# EAGLE design ESP32_WROVER_iot_module (EAGLE 9.6.2)
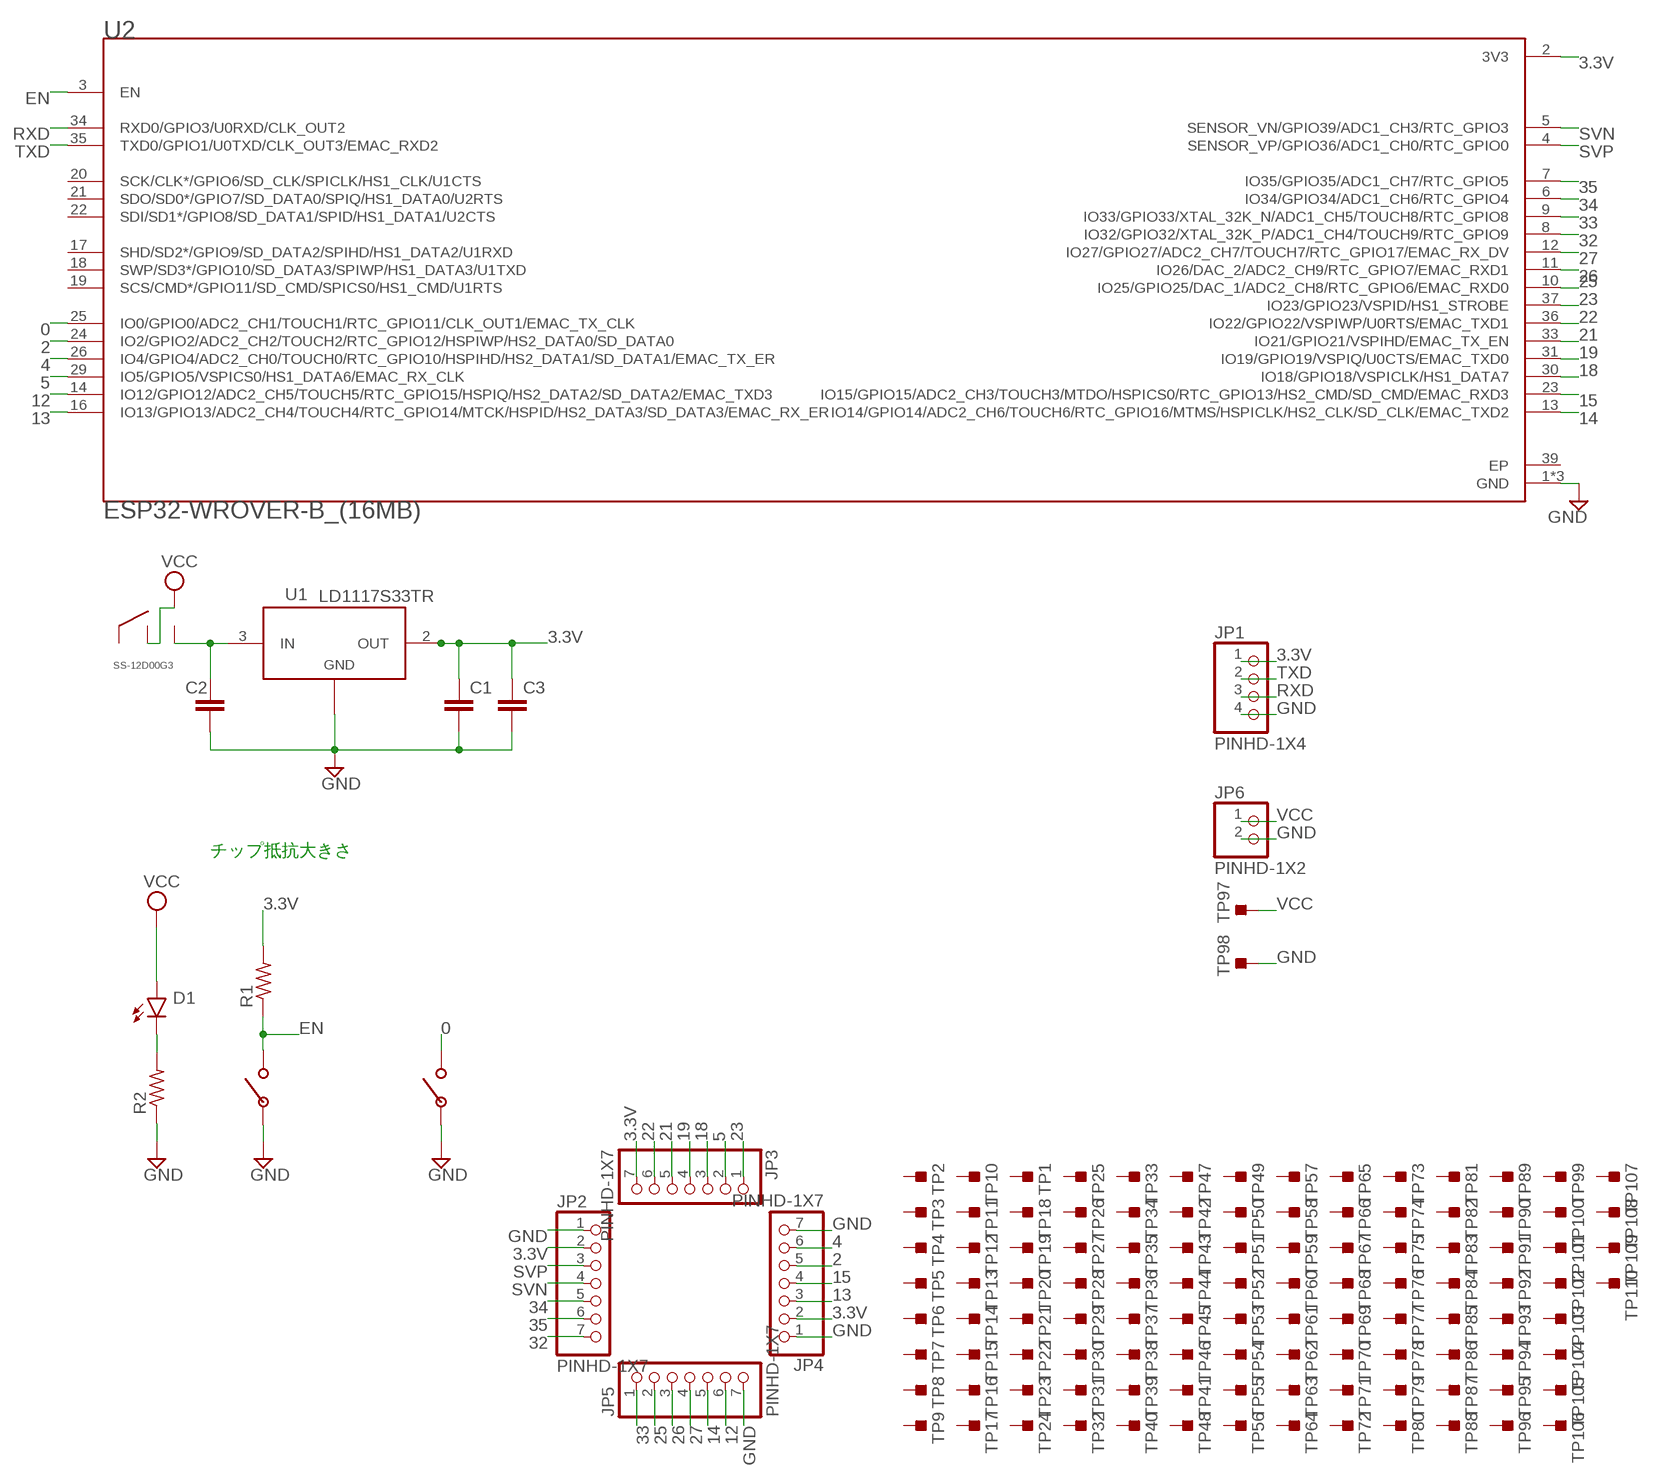
[diagram p0: schematic, sheet 1]

## Parts
C1  C-EUC0805K  [C0805K]
C2  C-EUC0805K  [C0805K]
C3  C-EUC0805K  [C0805K]
D1  LED_BLUE  LED_CHIP_BLUE-1608  [LEDC1608X39N_B]
JP1  PINHD-1X4  [1X04]
JP2  PINHD-1X7  [1X07]
JP3  PINHD-1X7  [1X07]
JP4  PINHD-1X7  [1X07]
JP5  PINHD-1X7  [1X07]
JP6  PINHD-1X2  [1X02]
R1  R-US_R0603  [R0603]
R2  R-US_R0603  [R0603]
SW1  TVAF06-A020B-R  [TVAF06-A020B-R]
SW2  TVAF06-A020B-R  [TVAF06-A020B-R]
SW3  SS-12D00G3  [SS-12D00G3]
TP1  TESTPOINT_TPS-PAD-036  [TESTPOINT_PAD-036]
TP2  TESTPOINT_TPS-PAD-036  [TESTPOINT_PAD-036]
TP3  TESTPOINT_TPS-PAD-036  [TESTPOINT_PAD-036]
TP4  TESTPOINT_TPS-PAD-036  [TESTPOINT_PAD-036]
TP5  TESTPOINT_TPS-PAD-036  [TESTPOINT_PAD-036]
TP6  TESTPOINT_TPS-PAD-036  [TESTPOINT_PAD-036]
TP7  TESTPOINT_TPS-PAD-036  [TESTPOINT_PAD-036]
TP8  TESTPOINT_TPS-PAD-036  [TESTPOINT_PAD-036]
TP9  TESTPOINT_TPS-PAD-036  [TESTPOINT_PAD-036]
TP10  TESTPOINT_TPS-PAD-036  [TESTPOINT_PAD-036]
TP11  TESTPOINT_TPS-PAD-036  [TESTPOINT_PAD-036]
TP12  TESTPOINT_TPS-PAD-036  [TESTPOINT_PAD-036]
TP13  TESTPOINT_TPS-PAD-036  [TESTPOINT_PAD-036]
TP14  TESTPOINT_TPS-PAD-036  [TESTPOINT_PAD-036]
TP15  TESTPOINT_TPS-PAD-036  [TESTPOINT_PAD-036]
TP16  TESTPOINT_TPS-PAD-036  [TESTPOINT_PAD-036]
TP17  TESTPOINT_TPS-PAD-036  [TESTPOINT_PAD-036]
TP18  TESTPOINT_TPS-PAD-036  [TESTPOINT_PAD-036]
TP19  TESTPOINT_TPS-PAD-036  [TESTPOINT_PAD-036]
TP20  TESTPOINT_TPS-PAD-036  [TESTPOINT_PAD-036]
TP21  TESTPOINT_TPS-PAD-036  [TESTPOINT_PAD-036]
TP22  TESTPOINT_TPS-PAD-036  [TESTPOINT_PAD-036]
TP23  TESTPOINT_TPS-PAD-036  [TESTPOINT_PAD-036]
TP24  TESTPOINT_TPS-PAD-036  [TESTPOINT_PAD-036]
TP25  TESTPOINT_TPS-PAD-036  [TESTPOINT_PAD-036]
TP26  TESTPOINT_TPS-PAD-036  [TESTPOINT_PAD-036]
TP27  TESTPOINT_TPS-PAD-036  [TESTPOINT_PAD-036]
TP28  TESTPOINT_TPS-PAD-036  [TESTPOINT_PAD-036]
TP29  TESTPOINT_TPS-PAD-036  [TESTPOINT_PAD-036]
TP30  TESTPOINT_TPS-PAD-036  [TESTPOINT_PAD-036]
TP31  TESTPOINT_TPS-PAD-036  [TESTPOINT_PAD-036]
TP32  TESTPOINT_TPS-PAD-036  [TESTPOINT_PAD-036]
TP33  TESTPOINT_TPS-PAD-036  [TESTPOINT_PAD-036]
TP34  TESTPOINT_TPS-PAD-036  [TESTPOINT_PAD-036]
TP35  TESTPOINT_TPS-PAD-036  [TESTPOINT_PAD-036]
TP36  TESTPOINT_TPS-PAD-036  [TESTPOINT_PAD-036]
TP37  TESTPOINT_TPS-PAD-036  [TESTPOINT_PAD-036]
TP38  TESTPOINT_TPS-PAD-036  [TESTPOINT_PAD-036]
TP39  TESTPOINT_TPS-PAD-036  [TESTPOINT_PAD-036]
TP40  TESTPOINT_TPS-PAD-036  [TESTPOINT_PAD-036]
TP41  TESTPOINT_TPS-PAD-036  [TESTPOINT_PAD-036]
TP42  TESTPOINT_TPS-PAD-036  [TESTPOINT_PAD-036]
TP43  TESTPOINT_TPS-PAD-036  [TESTPOINT_PAD-036]
TP44  TESTPOINT_TPS-PAD-036  [TESTPOINT_PAD-036]
TP45  TESTPOINT_TPS-PAD-036  [TESTPOINT_PAD-036]
TP46  TESTPOINT_TPS-PAD-036  [TESTPOINT_PAD-036]
TP47  TESTPOINT_TPS-PAD-036  [TESTPOINT_PAD-036]
TP48  TESTPOINT_TPS-PAD-036  [TESTPOINT_PAD-036]
TP49  TESTPOINT_TPS-PAD-036  [TESTPOINT_PAD-036]
TP50  TESTPOINT_TPS-PAD-036  [TESTPOINT_PAD-036]
TP51  TESTPOINT_TPS-PAD-036  [TESTPOINT_PAD-036]
TP52  TESTPOINT_TPS-PAD-036  [TESTPOINT_PAD-036]
TP53  TESTPOINT_TPS-PAD-036  [TESTPOINT_PAD-036]
TP54  TESTPOINT_TPS-PAD-036  [TESTPOINT_PAD-036]
TP55  TESTPOINT_TPS-PAD-036  [TESTPOINT_PAD-036]
TP56  TESTPOINT_TPS-PAD-036  [TESTPOINT_PAD-036]
TP57  TESTPOINT_TPS-PAD-036  [TESTPOINT_PAD-036]
TP58  TESTPOINT_TPS-PAD-036  [TESTPOINT_PAD-036]
TP59  TESTPOINT_TPS-PAD-036  [TESTPOINT_PAD-036]
TP60  TESTPOINT_TPS-PAD-036  [TESTPOINT_PAD-036]
TP61  TESTPOINT_TPS-PAD-036  [TESTPOINT_PAD-036]
TP62  TESTPOINT_TPS-PAD-036  [TESTPOINT_PAD-036]
TP63  TESTPOINT_TPS-PAD-036  [TESTPOINT_PAD-036]
TP64  TESTPOINT_TPS-PAD-036  [TESTPOINT_PAD-036]
TP65  TESTPOINT_TPS-PAD-036  [TESTPOINT_PAD-036]
TP66  TESTPOINT_TPS-PAD-036  [TESTPOINT_PAD-036]
TP67  TESTPOINT_TPS-PAD-036  [TESTPOINT_PAD-036]
TP68  TESTPOINT_TPS-PAD-036  [TESTPOINT_PAD-036]
TP69  TESTPOINT_TPS-PAD-036  [TESTPOINT_PAD-036]
TP70  TESTPOINT_TPS-PAD-036  [TESTPOINT_PAD-036]
TP71  TESTPOINT_TPS-PAD-036  [TESTPOINT_PAD-036]
TP72  TESTPOINT_TPS-PAD-036  [TESTPOINT_PAD-036]
TP73  TESTPOINT_TPS-PAD-036  [TESTPOINT_PAD-036]
TP74  TESTPOINT_TPS-PAD-036  [TESTPOINT_PAD-036]
TP75  TESTPOINT_TPS-PAD-036  [TESTPOINT_PAD-036]
TP76  TESTPOINT_TPS-PAD-036  [TESTPOINT_PAD-036]
TP77  TESTPOINT_TPS-PAD-036  [TESTPOINT_PAD-036]
TP78  TESTPOINT_TPS-PAD-036  [TESTPOINT_PAD-036]
TP79  TESTPOINT_TPS-PAD-036  [TESTPOINT_PAD-036]
TP80  TESTPOINT_TPS-PAD-036  [TESTPOINT_PAD-036]
TP81  TESTPOINT_TPS-PAD-036  [TESTPOINT_PAD-036]
TP82  TESTPOINT_TPS-PAD-036  [TESTPOINT_PAD-036]
TP83  TESTPOINT_TPS-PAD-036  [TESTPOINT_PAD-036]
TP84  TESTPOINT_TPS-PAD-036  [TESTPOINT_PAD-036]
TP85  TESTPOINT_TPS-PAD-036  [TESTPOINT_PAD-036]
TP86  TESTPOINT_TPS-PAD-036  [TESTPOINT_PAD-036]
TP87  TESTPOINT_TPS-PAD-036  [TESTPOINT_PAD-036]
TP88  TESTPOINT_TPS-PAD-036  [TESTPOINT_PAD-036]
TP89  TESTPOINT_TPS-PAD-036  [TESTPOINT_PAD-036]
TP90  TESTPOINT_TPS-PAD-036  [TESTPOINT_PAD-036]
TP91  TESTPOINT_TPS-PAD-036  [TESTPOINT_PAD-036]
TP92  TESTPOINT_TPS-PAD-036  [TESTPOINT_PAD-036]
TP93  TESTPOINT_TPS-PAD-036  [TESTPOINT_PAD-036]
TP94  TESTPOINT_TPS-PAD-036  [TESTPOINT_PAD-036]
TP95  TESTPOINT_TPS-PAD-036  [TESTPOINT_PAD-036]
TP96  TESTPOINT_TPS-PAD-036  [TESTPOINT_PAD-036]
TP97  TESTPOINT_TPS-PAD-036  [TESTPOINT_PAD-036]
TP98  TESTPOINT_TPS-PAD-036  [TESTPOINT_PAD-036]
TP99  TESTPOINT_TPS-PAD-036  [TESTPOINT_PAD-036]
TP100  TESTPOINT_TPS-PAD-036  [TESTPOINT_PAD-036]
TP101  TESTPOINT_TPS-PAD-036  [TESTPOINT_PAD-036]
TP102  TESTPOINT_TPS-PAD-036  [TESTPOINT_PAD-036]
TP103  TESTPOINT_TPS-PAD-036  [TESTPOINT_PAD-036]
TP104  TESTPOINT_TPS-PAD-036  [TESTPOINT_PAD-036]
TP105  TESTPOINT_TPS-PAD-036  [TESTPOINT_PAD-036]
TP106  TESTPOINT_TPS-PAD-036  [TESTPOINT_PAD-036]
TP107  TESTPOINT_TPS-PAD-036  [TESTPOINT_PAD-036]
TP108  TESTPOINT_TPS-PAD-036  [TESTPOINT_PAD-036]
TP109  TESTPOINT_TPS-PAD-036  [TESTPOINT_PAD-036]
TP110  TESTPOINT_TPS-PAD-036  [TESTPOINT_PAD-036]
U1  LD1117S33TR  [SOT-223]
U2  ESP32-WROVER-B_(16MB)  [XCVR_ESP32-WROVER-B_(16MB)]

## Nets
0: SW2.P$1 U2.25(IO0/GPIO0/ADC2_CH1/TOUCH1/RTC_GPIO11/CLK_OUT1/EMAC_TX_CLK)
2: JP4.5 U2.24(IO2/GPIO2/ADC2_CH2/TOUCH2/RTC_GPIO12/HSPIWP/HS2_DATA0/SD_DATA0)
3.3V [supply]: C1.1 C3.1 JP1.1 JP2.2 JP3.7 JP4.2 R1.2 U1.2(OUT) U1.4 U2.2(3V3)
4: JP4.6 U2.26(IO4/GPIO4/ADC2_CH0/TOUCH0/RTC_GPIO10/HSPIHD/HS2_DATA1/SD_DATA1/EMAC_TX_ER)
5: JP3.2 U2.29(IO5/GPIO5/VSPICS0/HS1_DATA6/EMAC_RX_CLK)
12: JP5.6 U2.14(IO12/GPIO12/ADC2_CH5/TOUCH5/RTC_GPIO15/HSPIQ/HS2_DATA2/SD_DATA2/EMAC_TXD3)
13: JP4.3 U2.16(IO13/GPIO13/ADC2_CH4/TOUCH4/RTC_GPIO14/MTCK/HSPID/HS2_DATA3/SD_DATA3/EMAC_RX_ER)
14: JP5.5 U2.13(IO14/GPIO14/ADC2_CH6/TOUCH6/RTC_GPIO16/MTMS/HSPICLK/HS2_CLK/SD_CLK/EMAC_TXD2)
15: JP4.4 U2.23(IO15/GPIO15/ADC2_CH3/TOUCH3/MTDO/HSPICS0/RTC_GPIO13/HS2_CMD/SD_CMD/EMAC_RXD3)
18: JP3.3 U2.30(IO18/GPIO18/VSPICLK/HS1_DATA7)
19: JP3.4 U2.31(IO19/GPIO19/VSPIQ/U0CTS/EMAC_TXD0)
21: JP3.5 U2.33(IO21/GPIO21/VSPIHD/EMAC_TX_EN)
22: JP3.6 U2.36(IO22/GPIO22/VSPIWP/U0RTS/EMAC_TXD1)
23: JP3.1 U2.37(IO23/GPIO23/VSPID/HS1_STROBE)
25: JP5.2 U2.10(IO25/GPIO25/DAC_1/ADC2_CH8/RTC_GPIO6/EMAC_RXD0)
26: JP5.3 U2.11(IO26/DAC_2/ADC2_CH9/RTC_GPIO7/EMAC_RXD1)
27: JP5.4 U2.12(IO27/GPIO27/ADC2_CH7/TOUCH7/RTC_GPIO17/EMAC_RX_DV)
32: JP2.7 U2.8(IO32/GPIO32/XTAL_32K_P/ADC1_CH4/TOUCH9/RTC_GPIO9)
33: JP5.1 U2.9(IO33/GPIO33/XTAL_32K_N/ADC1_CH5/TOUCH8/RTC_GPIO8)
34: JP2.5 U2.6(IO34/GPIO34/ADC1_CH6/RTC_GPIO4)
35: JP2.6 U2.7(IO35/GPIO35/ADC1_CH7/RTC_GPIO5)
EN: R1.1 SW1.P$1 U2.3(EN)
GND [supply]: C1.2 C2.2 C3.2 JP1.4 JP2.1 JP4.1 JP4.7 JP5.7 JP6.2 R2.1 SW1.P$2 SW2.P$2 TP98.1(TP) U1.1(ADJ/GND) U2.1(GND) U2.15(GND) U2.38(GND)
N$1: D1.1(C) R2.2
RXD: JP1.3 U2.34(RXD0/GPIO3/U0RXD/CLK_OUT2)
SVN: JP2.4 U2.5(SENSOR_VN/GPIO39/ADC1_CH3/RTC_GPIO3)
SVP: JP2.3 U2.4(SENSOR_VP/GPIO36/ADC1_CH0/RTC_GPIO0)
TXD: JP1.2 U2.35(TXD0/GPIO1/U0TXD/CLK_OUT3/EMAC_RXD2)
VCC [supply]: D1.2(A) JP6.1 SW3.P$2 TP97.1(TP)
VIN [supply]: C2.1 SW3.P$3 U1.3(IN)
Unconnected: SW3.P$1 TP1.1(TP) TP2.1(TP) TP3.1(TP) TP4.1(TP) TP5.1(TP) TP6.1(TP) TP7.1(TP) TP8.1(TP) TP9.1(TP) TP10.1(TP) TP11.1(TP) TP12.1(TP) TP13.1(TP) TP14.1(TP) TP15.1(TP) TP16.1(TP) TP17.1(TP) TP18.1(TP) TP19.1(TP) TP20.1(TP) TP21.1(TP) TP22.1(TP) TP23.1(TP) TP24.1(TP) TP25.1(TP) TP26.1(TP) TP27.1(TP) TP28.1(TP) TP29.1(TP) TP30.1(TP) TP31.1(TP) TP32.1(TP) TP33.1(TP) TP34.1(TP) TP35.1(TP) TP36.1(TP) TP37.1(TP) TP38.1(TP) TP39.1(TP) TP40.1(TP) TP41.1(TP) TP42.1(TP) TP43.1(TP) TP44.1(TP) TP45.1(TP) TP46.1(TP) TP47.1(TP) TP48.1(TP) TP49.1(TP) TP50.1(TP) TP51.1(TP) TP52.1(TP) TP53.1(TP) TP54.1(TP) TP55.1(TP) TP56.1(TP) TP57.1(TP) TP58.1(TP) TP59.1(TP) TP60.1(TP) TP61.1(TP) TP62.1(TP) TP63.1(TP) TP64.1(TP) TP65.1(TP) TP66.1(TP) TP67.1(TP) TP68.1(TP) TP69.1(TP) TP70.1(TP) TP71.1(TP) TP72.1(TP) TP73.1(TP) TP74.1(TP) TP75.1(TP) TP76.1(TP) TP77.1(TP) TP78.1(TP) TP79.1(TP) TP80.1(TP) TP81.1(TP) TP82.1(TP) TP83.1(TP) TP84.1(TP) TP85.1(TP) TP86.1(TP) TP87.1(TP) TP88.1(TP) TP89.1(TP) TP90.1(TP) TP91.1(TP) TP92.1(TP) TP93.1(TP) TP94.1(TP) TP95.1(TP) TP96.1(TP) TP99.1(TP) TP100.1(TP) TP101.1(TP) TP102.1(TP) TP103.1(TP) TP104.1(TP) TP105.1(TP) TP106.1(TP) TP107.1(TP) TP108.1(TP) TP109.1(TP) TP110.1(TP) U2.17(SHD/SD2*/GPIO9/SD_DATA2/SPIHD/HS1_DATA2/U1RXD) U2.18(SWP/SD3*/GPIO10/SD_DATA3/SPIWP/HS1_DATA3/U1TXD) U2.19(SCS/CMD*/GPIO11/SD_CMD/SPICS0/HS1_CMD/U1RTS) U2.20(SCK/CLK*/GPIO6/SD_CLK/SPICLK/HS1_CLK/U1CTS) U2.21(SDO/SD0*/GPIO7/SD_DATA0/SPIQ/HS1_DATA0/U2RTS) U2.22(SDI/SD1*/GPIO8/SD_DATA1/SPID/HS1_DATA1/U2CTS)

## Notes on the sheet
- チップ抵抗大きさ

## Power pins joined to a net without a drawn wire
GND: U2.39(EP)

## Library data of the parts
C1-C3 = myParts:C-EU: CAPACITOR, European symbol; SPICEPREFIX: C
D1 = Opto-Electronic:LED_CHIP: LED - Generic; CATEGORY: Opto-Electronic; COLOR: Blue; SUB-CATEGORY: LED
JP1 = Connector:PINHD-1X4: PIN HEADER; CATEGORY: CONNECTOR; SUB-CATEGORY: PIN-HEADER
JP2-JP5 = Connector:PINHD-1X7: PIN HEADER; CATEGORY: CONNECTOR; SUB-CATEGORY: PIN-HEADER
JP6 = Connector:PINHD-1X2: PIN HEADER; CATEGORY: CONNECTOR; SUB-CATEGORY: PIN-HEADER
R1 R2 = myParts:R-US_: RESISTOR, American symbol; SPICEPREFIX: R
SW1 SW2 = myParts:TVAF06-A020B-R: ■主な仕様 ・接点構成：1回路1接点(SPST) ・定格電圧：DC12V ・定格電流：50mA ・最小電圧：DC1V ・最小電流：10μA ・実装タイプ：面実装 ・使用温度範囲：-20~70℃ ・高さ：2.0mm
SW3 = myParts:SS-12D00G3: ・種別：スライドスイッチ ・表記：ON-ON ・回路数：1回路 ・接点：2接点 ・定格開閉電圧：30VDC ・定格開閉電流：0.3A ・接触抵抗：100mΩ以下 ・切替タイミング：ノンショート ・取付タイプ：基板取付 ・電気的接続：スルーホール実装 ・ピン数：3; AKIDUKI: P-15707
TP1-TP110 = LinkedLibrary52101:TESTPOINT_TPS: TEST POINT PAD; BOM: EXCLUDE
U1 = IC:LD1117S33TR: IC REG LINEAR 3.3V 800MA SOT223 Manufacturer's datasheet <http://www.st.com/content/ccc/resource/technical/document/datasheet/99/3b/7d/91/91/51/4b/be/CD00000544.pdf/files/CD00000544.pdf/jcr:content/translations/en.CD00000544.pdf>; CREATED_BY: PCBLayout.com; DIGIKEY_PART_NUMBER: 497-1242-2-ND; MANUFACTURER: STMicroelectronics; MPN: LD1117S33TR; PACKAGE: SOT-223
U2 = ESP32-WROVER-B_OUT_BOARD:ESP32-WROVER-B_(16MB): WiFi SMD Module, ESP32-WROVER-B, 16MB Flash memory Check availability <https://pricing.snapeda.com/parts/ESP32-WROVER-B%20%2816MB%29/Espressif%20Systems/view-part?ref=eda>; AVAILABILITY: In Stock; DESCRIPTION: Bluetooth, WiFi 802.11b/g/n, Bluetooth v4.2 +EDR, Class 1, 2 and 3 Transceiver Module 2.4GHz ~ 2.5GHz PCB Trace Surface Mount; MF: Espressif Systems; MP: ESP32-WROVER-B (16MB); PACKAGE: Module Espressif Systems; PRICE: None; PURCHASE-URL: https://pricing.snapeda.com/search/part/ESP32-WROVER-B (16MB)/?ref=eda

## Net classes
0 default: width 0.305 mm, clearance 0.152 mm
1 supply: width 0.635 mm, clearance 0.318 mm

## Board
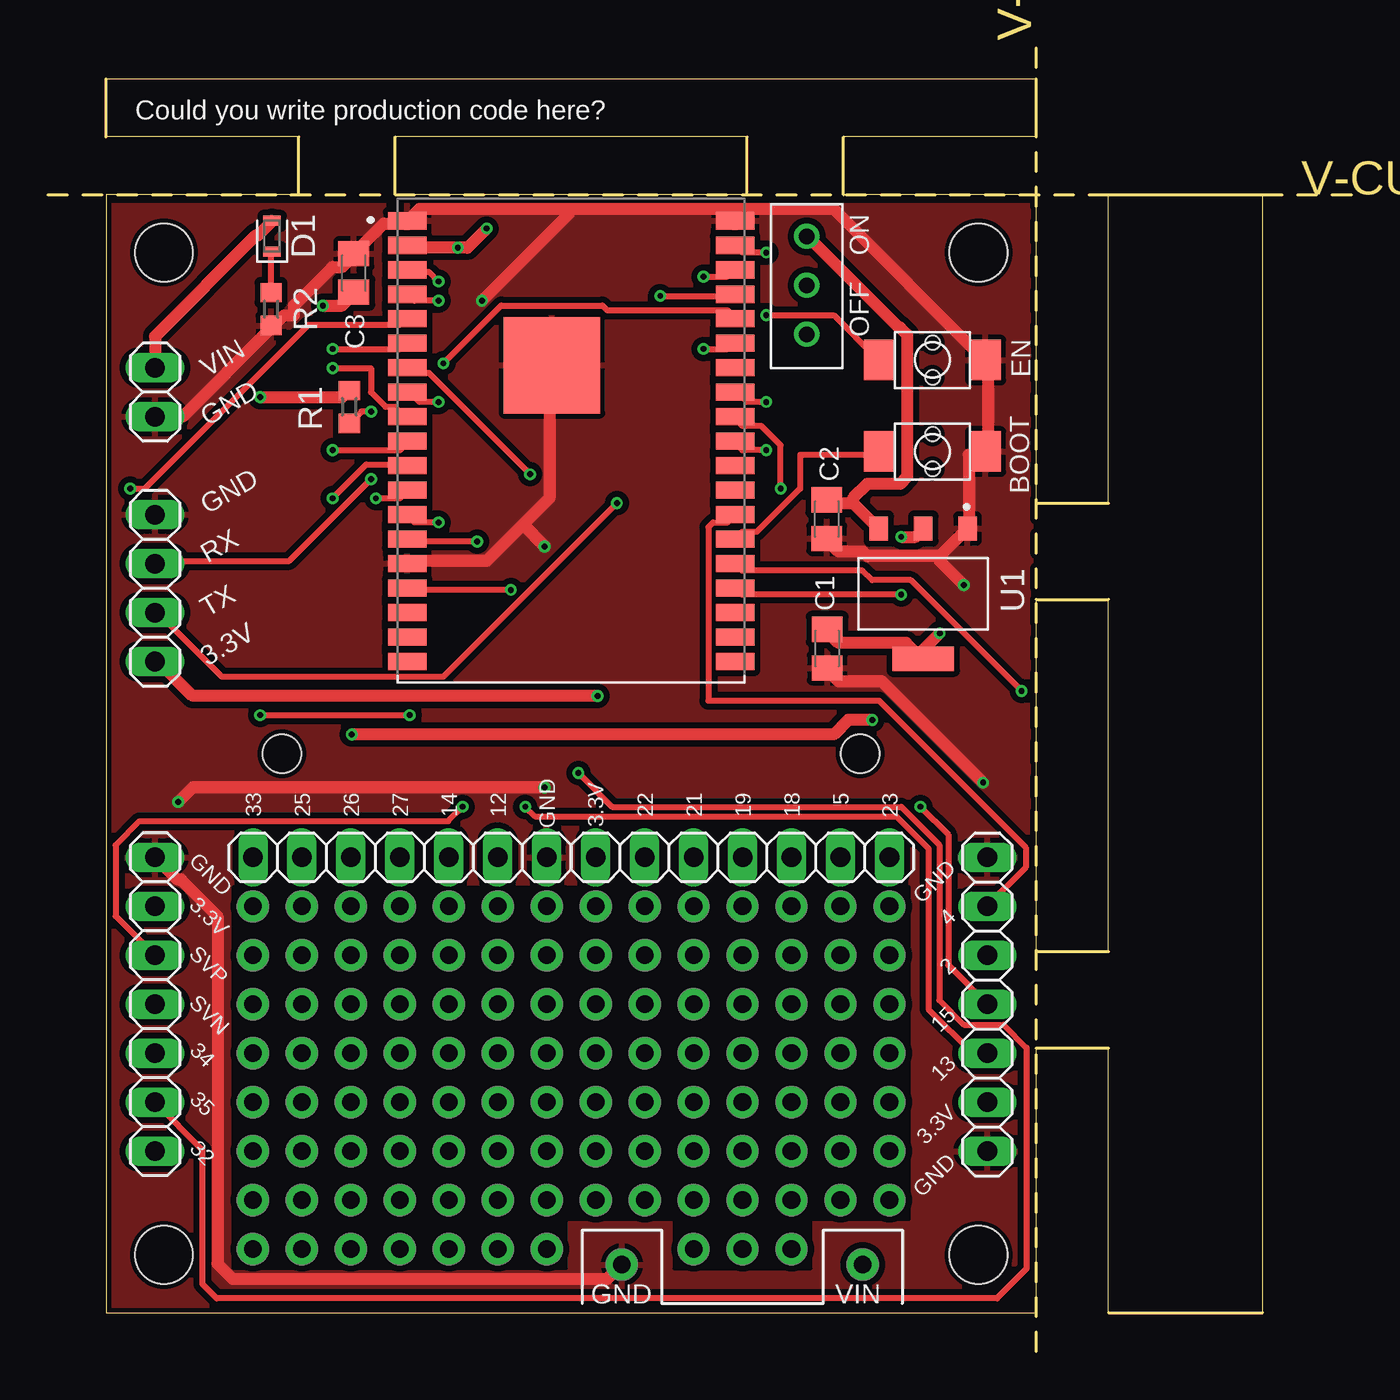
[diagram p1: board, top side]
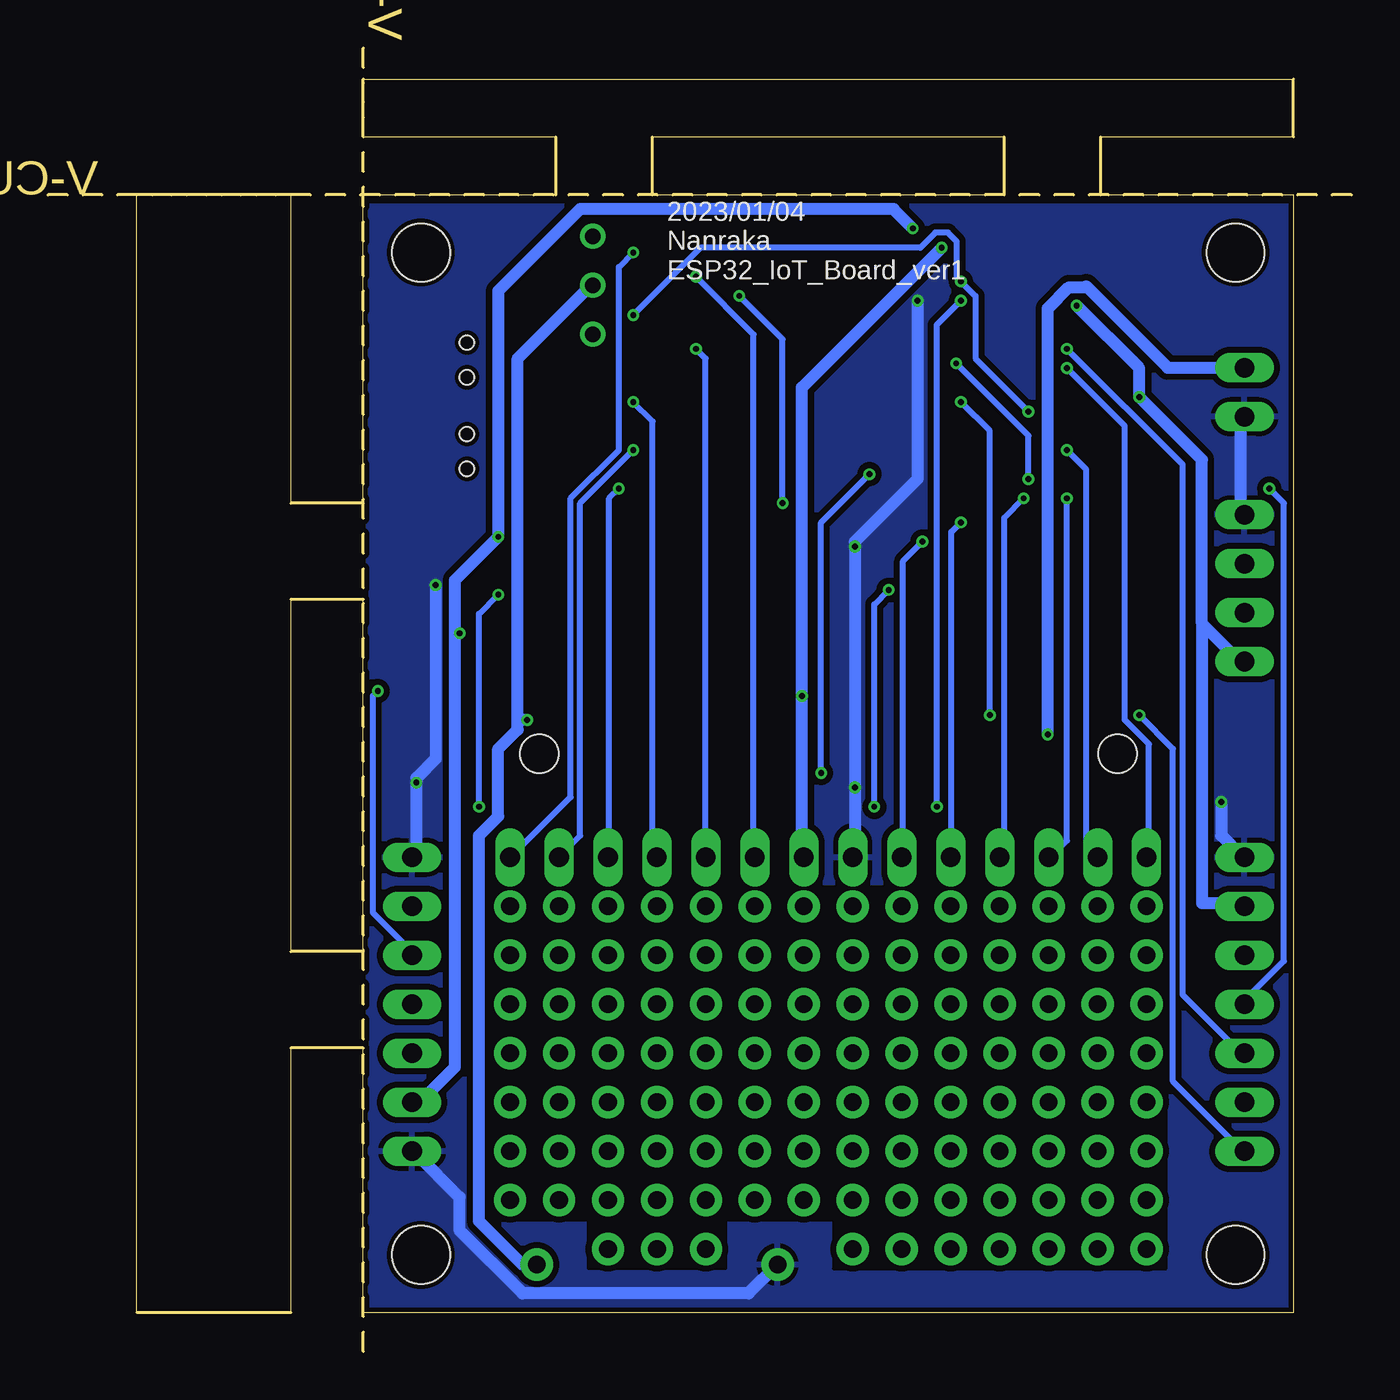
[diagram p2: board, bottom side, seen from below]

Size 67.6 x 67.6 mm. Coordinates in mm from the lower left corner, seen from the top.
Outline: 0,60 68,60
Outline: 51.26,0 51.26,68
Outline: 3,2 51.26,2 51.26,15.74 55,15.74 55,2 63,2 63,60 55,60 55,44 51.26,44 51.26,60 41.26,60 41.26,63 51.26,63 51.26,66 3,66 3,63 13,63 13,60 3,60 3,2
Outline: 51.26,20.74 51.26,39 55,39 55,20.74 51.26,20.74
Outline: 36.26,60 18,60 18,63 36.26,63 36.26,60
Copper layers (1*16): Top 0.035mm / dielectric 1.5mm / Bottom 0.035mm
Design rules "SeeedStudio_2layer_DRU_no_angle_20140221": minimum track width 6mil, minimum drill 12mil, track to track 6mil, track to pad 6mil, pad to pad 6mil, via to via 6mil, smd to smd 0mil, copper to edge 10mil, drill to drill 10mil, minimum pad ring 10mil, minimum via ring 6mil, stop-mask expansion 2mil, vias tented up to drill 100mil, thermal gap 10mil
Holes 2 mm at 12.13,31 42.13,31
Holes 3 mm at 6,5 48.26,5 48.26,57 6,57
tRestrict: area 9.6,4.3 to 26.9,24.1; area 26.9,6.8 to 44.7,24.1; area 32.5,4.3 to 39.6,6.8
bRestrict: area 9.6,4.3 to 26.9,24.1; area 26.9,6.8 to 44.7,24.1; area 32.5,4.3 to 39.6,6.8

### Footprints (pad centres in the part's own frame; a part is rotated, then mirrored left to right if it is on the bottom)
C0805K = smd 1.3 x 1.6: 1 -1,0; 2 1,0
LEDC1608X39N_B = smd 0.512 x 0.912: 1 -0.8,0; 2 0.8,0
1X04 = drill 1.016 long: 1 -3.81,0; 2 -1.27,0; 3 1.27,0; 4 3.81,0
1X07 = drill 1.016 long: 1 -7.62,0; 2 -5.08,0; 3 -2.54,0; 4 0,0; 5 2.54,0; 6 5.08,0; 7 7.62,0
1X02 = drill 1.016 long: 1 -1.27,0; 2 1.27,0
R0603 = smd 1 x 1.1: 1 -0.85,0; 2 0.85,0
TVAF06-A020B-R = smd 2.1 x 1.6: P$1 0,2.75; P$2 0,-2.75 | hole 0.75: -0.9,0; 0.9,0
SS-12D00G3 = drill 0.8: P$1 -2.5,0; P$2 0.04,0; P$3 2.58,0
TESTPOINT_PAD-036 = drill 0.914 pad 1.676: 1 0,0
SOT-223 = smd 1.26 x 0.96: 1 -3.375,2.3; 2 -3.375,0; 3 -3.375,-2.3 | smd 1.26 x 3.19: 4 3.375,0
XCVR_ESP32-WROVER-B_(16MB) = smd 2 x 0.9: 1 -8.5,8.26; 2 -8.5,6.99; 3 -8.5,5.72; 4 -8.5,4.45; 5 -8.5,3.18; 6 -8.5,1.91; 7 -8.5,0.64; 8 -8.5,-0.63; 9 -8.5,-1.9; 10 -8.5,-3.17; 11 -8.5,-4.44; 12 -8.5,-5.71; 13 -8.5,-6.98; 14 -8.5,-8.25; 15 -8.5,-9.52; 16 -8.5,-10.79; 17 -8.5,-12.06; 18 -8.5,-13.33; 19 -8.5,-14.6; 20 8.5,-14.6; 21 8.5,-13.33; 22 8.5,-12.06; 23 8.5,-10.79; 24 8.5,-9.52; 25 8.5,-8.25; 26 8.5,-6.98; 27 8.5,-5.71; 28 8.5,-4.44; 29 8.5,-3.17; 30 8.5,-1.9; 31 8.5,-0.63; 32 8.5,0.64; 33 8.5,1.91; 34 8.5,3.18; 35 8.5,4.45; 36 8.5,5.72; 37 8.5,6.99; 38 8.5,8.26 | smd 5 x 5: 39 -1,0.76

### Placement (x,y rotation side)
C1  40.41,36.45 270 top
C2  40.39,43.17 270 top
C3  15.85,55.94 90 top
D1  11.61,57.85 90 top
JP1  5.54,39.59 90 top
JP2  5.54,18 270 top
JP3  36.02,25.62 180 top
JP4  48.72,18 90 top
JP5  18.24,25.62 0 top
JP6  5.54,49.75 270 top
R1  15.62,48.99 90 top
R2  11.56,54.07 90 top
SW1  45.88,51.43 90 top
SW2  45.88,46.68 90 top
SW3  39.35,55.26 90 top
TP1  18.24,5.3 0 top
TP2  23.32,20.54 0 top
TP3  23.32,18 0 top
TP4  23.32,10.38 0 top
TP5  23.32,15.46 0 top
TP6  23.32,12.92 0 top
TP7  20.78,20.54 0 top
TP8  20.78,18 0 top
TP9  20.78,15.46 0 top
TP10  20.78,12.92 0 top
TP11  20.78,10.38 0 top
TP12  20.78,5.3 0 top
TP13  23.32,7.84 0 top
TP14  20.78,7.84 0 top
TP15  23.32,5.3 0 top
TP16  18.24,23.08 0 top
TP17  20.78,23.08 0 top
TP18  18.24,20.54 0 top
TP19  23.32,23.08 0 top
TP20  18.24,15.46 0 top
TP21  18.24,10.38 0 top
TP22  18.24,18 0 top
TP23  18.24,7.84 0 top
TP24  18.24,12.92 0 top
TP25  15.7,23.08 0 top
TP26  10.62,15.46 0 top
TP27  28.4,23.08 0 top
TP28  15.7,20.54 0 top
TP29  10.62,12.92 0 top
TP30  30.94,23.08 0 top
TP31  15.7,18 0 top
TP32  10.62,7.84 0 top
TP33  30.94,20.54 0 top
TP34  15.7,12.92 0 top
TP35  10.62,5.3 0 top
TP36  30.94,18 0 top
TP37  15.7,15.46 0 top
TP38  43.64,18 0 top
TP39  30.94,15.46 0 top
TP40  15.7,10.38 0 top
TP41  43.64,15.46 0 top
TP42  30.94,12.92 0 top
TP43  15.7,7.84 0 top
TP44  43.64,12.92 0 top
TP45  30.94,10.38 0 top
TP46  15.7,5.3 0 top
TP47  43.64,10.38 0 top
TP48  30.94,7.84 0 top
TP49  13.16,23.08 0 top
TP50  43.64,7.84 0 top
TP51  36.02,7.84 0 top
TP52  36.02,23.08 0 top
TP53  13.16,20.54 0 top
TP54  36.02,5.3 0 top
TP55  28.4,20.54 0 top
TP56  38.56,23.08 0 top
TP57  13.16,18 0 top
TP58  33.48,20.54 0 top
TP59  28.4,18 0 top
TP60  41.1,23.08 0 top
TP61  13.16,15.46 0 top
TP62  36.02,18 0 top
TP63  28.4,15.46 0 top
TP64  43.64,23.08 0 top
TP65  13.16,12.92 0 top
TP66  25.86,23.08 0 top
TP67  36.02,12.92 0 top
TP68  43.64,20.54 0 top
TP69  13.16,10.38 0 top
TP70  25.86,20.54 0 top
TP71  28.4,12.92 0 top
TP72  41.1,20.54 0 top
TP73  10.62,10.38 0 top
TP74  25.86,18 0 top
TP75  28.4,10.38 0 top
TP76  33.48,18 0 top
TP77  13.16,7.84 0 top
TP78  25.86,15.46 0 top
TP79  28.4,7.84 0 top
TP80  33.48,15.46 0 top
TP81  13.16,5.3 0 top
TP82  25.86,12.92 0 top
TP83  36.02,10.38 0 top
TP84  33.48,10.38 0 top
TP85  10.62,23.08 0 top
TP86  25.86,10.38 0 top
TP87  33.48,23.08 0 top
TP88  33.48,7.84 0 top
TP89  10.62,20.54 0 top
TP90  25.86,7.84 0 top
TP91  36.02,20.54 0 top
TP92  33.48,5.3 0 top
TP93  10.62,18 0 top
TP94  25.86,5.3 0 top
TP95  33.48,12.92 0 top
TP96  36.02,15.46 0 top
TP97  42.26,4.5 0 top
TP98  29.76,4.5 0 top
TP99  38.56,15.46 0 top
TP100  41.1,18 0 top
TP101  41.1,15.46 0 top
TP102  41.1,12.92 0 top
TP103  41.1,10.38 0 top
TP104  41.1,7.84 0 top
TP105  38.56,20.54 0 top
TP106  38.56,18 0 top
TP107  38.56,12.92 0 top
TP108  38.56,7.84 0 top
TP109  38.56,5.3 0 top
TP110  38.56,10.38 0 top
U1  45.39,39.3 270 top
U2  27.13,50.39 0 top

### Tracks (layer width: path | path; a pad name or v marks a point on that pad's centre or on a via)
0
  Top 0.305: U2.25 35.75,42.25 36,42.5 36.75,42.5 39,44.75 39,46.5 43,46.5 SW2.P$1
2  (via drill 0.3)
  Top 0.305: v50.5,34.25 44.75,40 42.75,40 42.25,40.5 36,40.5 35.75,40.75 U2.24
  Bottom 0.305: v50.5,34.25 50.75,34 50.75,22.75 48.75,20.75 JP4.5
3.3V  (via drill 0.3)
  Top 0.635: v11,49.5 15.25,49.5 15.5,49.75 R1.2 | v14.25,54.25 15.25,54.25 15.75,54.75 C3.1 | C1.1 40.5,37.25 41,36.75 44.5,36.75 45.25,36 U1.4 45.25,36.25 v46.25,37.25 | v44.25,42.25 45,42.25 45.25,42.5 U1.2 | U2.2 18.75,57.25 v21.25,57.25 21.75,57.25 v22.75,58.25 | v28.5,34 7.5,34 5.75,35.75 JP1.1
  Bottom 0.635: 7.75,37.75 7.75,46.25 v11,49.5 11,51 v14.25,54.25 | 7.75,37.75 5.75,35.75 JP1.1 | 7.75,37.75 7.75,23.25 5.75,23.25 JP2.2 | 46.5,37.25 46.5,14.75 48.5,12.75 JP4.2 | 46.5,37.25 46.5,40 v44.25,42.25 44.25,55 40,59.25 23.75,59.25 v22.75,58.25 | v46.25,37.25 46.5,37.25 | v21.25,57.25 28.5,50 v28.5,34 28.5,25.75 JP3.7
4
  Top 0.305: U2.26 35.5,43.25 35.25,43 34.5,43 34.25,42.75 34.25,33.75 43.1,33.75 50.71,26.13 50.71,25.11 48.72,23.12 JP4.6
5  (via drill 0.3)
  Top 0.305: v37.25,46.75 36,46.75 35.75,47 U2.29
  Bottom 0.305: v37.25,46.75 40,44 40,26.75 41,25.75 JP3.2
12  (via drill 0.3)
  Top 0.305: v22.25,42 18.75,42 U2.14
  Bottom 0.305: v22.25,42 23.25,41 23.25,25.75 JP5.6
13  (via drill 0.3)
  Top 0.305: v24,39.5 18.75,39.5 U2.16 | v24.75,28.25 25.25,27.75 44,27.75 45.67,26.08 45.67,17.75 47.96,15.46 JP4.3
  Bottom 0.305: v24,39.5 24.75,38.75 v24.75,28.25
14  (via drill 0.3)
  Top 0.305: v20.25,43 19,43 18.75,43.25 U2.13
  Bottom 0.305: v20.25,43 20.75,42.5 20.75,25.75 JP5.5
15  (via drill 0.3)
  Top 0.305: v44.25,39.25 36,39.25 35.75,39.5 U2.23 | JP4.4 46.69,20.03 46.69,26.81 v45.25,28.25
  Bottom 0.305: v44.25,39.25 45.25,38.25 v45.25,28.25
18  (via drill 0.3)
  Top 0.305: v38,44.75 38,47 37,48 36,48 35.75,48.25 U2.30
  Bottom 0.305: v38,44.75 38.5,44.25 38.5,25.75 JP3.3
19  (via drill 0.3)
  Top 0.305: v37.25,49.25 36.25,49.25 35.75,49.75 U2.31
  Bottom 0.305: v37.25,49.25 36.25,48.25 36.25,25.75 JP3.4
21  (via drill 0.3)
  Top 0.305: v34,52 35.25,52 35.5,52.25 U2.33
  Bottom 0.305: v34,52 33.5,51.5 33.5,25.75 JP3.5
22  (via drill 0.3)
  Top 0.305: v34,55.75 35.25,55.75 35.5,56 U2.36
  Bottom 0.305: v34,55.75 31,52.75 31,25.75 JP3.6
23  (via drill 0.3)
  Top 0.305: v37.25,57 36,57 35.75,57.25 U2.37
  Bottom 0.305: v37.25,57 38,56.25 38,46.75 40.5,44.25 40.5,28.75 43.5,25.75 JP3.1
25  (via drill 0.3)
  Top 0.305: v14.75,46.75 18.25,46.75 18.5,47 U2.10
  Bottom 0.305: v14.75,46.75 13.75,45.75 13.75,26.25 13.25,25.75 JP5.2
26  (via drill 0.3)
  Top 0.305: v14.75,44.25 16.5,46 18.5,46 U2.11
  Bottom 0.305: v14.75,44.25 14.75,26.5 15.5,25.75 JP5.3
27  (via drill 0.3)
  Top 0.305: v17,44.25 18.25,44.25 18.5,44.5 U2.12
  Bottom 0.305: v17,44.25 18,43.25 18,25.75 JP5.4
32  (via drill 0.3)
  Top 0.305: v20.25,49.25 19.25,49.25 18.75,49.75 U2.8 | v11,33 v18.75,33
  Bottom 0.305: v20.25,49.25 18.75,47.75 v18.75,33 | v11,33 9.25,31.25 9.25,14 5.75,10.5 JP2.7
33  (via drill 0.3)
  Top 0.305: v14.75,51 16.75,51 16.75,49.75 17.5,49 18,49 18.5,48.5 U2.9
  Bottom 0.305: v14.75,51 11.75,48 11.75,32.75 10.5,31.5 10.5,25.75 JP5.1
34  (via drill 0.3)
  Top 0.305: v14.75,52 18.25,52 18.5,52.25 U2.6
  Bottom 0.305: v14.75,52 8.75,46 8.75,18.5 5.75,15.5 JP2.5
35  (via drill 0.3)
  Top 0.305: v25,45.5 19.75,50.75 19,50.75 18.75,51 U2.7 | v27.5,30 29.25,28.25 44.25,28.25 46.23,26.27 46.23,18.22 47.52,16.94 49.56,16.94 50.75,15.75 50.75,4.28 49.22,2.75 8.75,2.75 8,3.5 8,10.46 JP2.6
  Bottom 0.305: v25,45.5 27.5,43 v27.5,30
EN  (via drill 0.3)
  Top 0.305: v16.75,48.75 16.25,48.75 15.75,48.25 R1.1 | v20.25,55.5 19.75,56 18.75,56 U2.3 | v37.25,53.75 40.75,53.75 43,51.5 SW1.P$1
  Bottom 0.305: v16.75,48.75 19.5,51.5 19.5,54.75 v20.25,55.5 20.46,55.71 20.46,57.58 20.92,58.04 21.58,58.04 22.36,57.25 33.75,57.25 v37.25,53.75
GND  (via drill 0.3)
  Top 0.635: TP98.1 29,3.75 9.58,3.75 8.79,4.54 8.79,22.57 6.88,24.48 6.68,24.48 JP2.1 | 24.62,42.88 26,44.25 26,51 U2.39 | 24.62,42.88 22.75,41 18.75,41 U2.15 | 24.62,42.88 v25.75,41.75 | JP6.2 5.75,48.5 7,48.5 11.5,53 R2.1 11.75,53.25 12.25,53.75 12.75,53.75 12.75,54.25 14.75,56.25 15.25,56.25 15.75,56.75 C3.2 16.99,58.08 16.99,58.09 17.41,58.5 18.5,58.5 U2.1 18.75,58.75 19.25,59.25 27,59.25 | v48.5,29.5 43.25,34.75 41,34.75 40.5,35.25 C1.2 | 46.25,41.25 42.5,41.25 42.25,41.5 41,41.5 40.5,42 C2.2 | 46.25,41.25 47.5,42.5 U1.1 47.75,42.75 47.75,46.5 48.5,46.5 SW2.P$2 48.75,46.75 48.75,51.25 SW1.P$2 48.5,51.5 40.75,59.25 36.25,59.25 36.12,59.12 | 36.12,59.12 35.75,58.75 U2.38 | v47.5,39.75 46.25,41 46.25,41.25 | 27,59.25 36,59.25 36.12,59.12 | v22.5,54.5 27,59 27,59.25 | v6.75,28.5 7.5,29.25 v25.75,29.25
  Bottom 0.635: JP4.1 48.5,10.25 46.25,8 46.25,6.25 43,3 31.26,3 TP98.1 | JP5.7 25.75,25.75 v25.75,29.25 v25.75,41.75 25.75,42 22.5,45.25 v22.5,54.5 | JP1.4 5.75,43.5 5.75,48.25 JP6.2 | JP4.7 48.5,25.75 v48.5,29.5 48.5,29.75 47.5,30.75 v47.5,39.75 | v6.75,28.5 6.75,26.75 5.75,25.75 JP2.1
  pour Bottom: 3.2,59.4 3.2,2.2 51.06,2.2 51.06,59.4
  pour Top: 3.2,59.4 3.2,2.2 51.06,2.2 51.06,59.4
N$1
  Top 0.305: D1.1 11.57,56.98 11.57,54.92 R2.2
RXD  (via drill 0.3)
  Top 0.305: v20.5,51.25 23.5,54.25 28.75,54.25 29,54 35.25,54 35.5,53.75 U2.34 | v16.75,45.25 12.5,41 5.75,41 JP1.3
  Bottom 0.305: v20.5,51.25 16.75,47.5 v16.75,45.25
SVN  (via drill 0.3)
  Top 0.305: v4.25,44.75 5,44.75 13.5,53.25 18.25,53.25 18.5,53.5 U2.5
  Bottom 0.305: v4.25,44.75 3.5,44 3.5,20.25 5.5,18.25 JP2.4
SVP  (via drill 0.3)
  Top 0.305: v20.25,54.5 19,54.5 18.75,54.75 U2.4 | v21.5,28.25 20.75,27.5 4.75,27.5 3.5,26.25 3.5,22.58 JP2.3
  Bottom 0.305: v20.25,54.5 21.5,53.25 v21.5,28.25
TXD  (via drill 0.3)
  Top 0.305: v31.75,54.75 35.5,54.75 U2.35 | v29.5,44 20.5,35 9,35 5.75,38.25 JP1.2
  Bottom 0.305: v31.75,54.75 29.5,52.5 v29.5,44
VCC  (via drill 0.3)
  Top 0.635: v15.75,32 40.75,32 41.5,32.75 v42.75,32.75 | D1.2 11.57,58.58 10.89,57.89 10.77,57.89 5.54,52.66 JP6.1
  Bottom 0.635: 43.25,32.75 43.25,32.25 44.25,31.25 44.25,27.75 45.25,26.75 45.25,6.75 43,4.5 TP97.1 | 43.25,32.75 43.25,51.5 39.5,55.25 SW3.P$2 | v42.75,32.75 43.25,32.75 | v15.75,32 15.75,54.1 14.64,55.2 13.8,55.2 13.75,55.25 9.52,51.02 JP6.1
VIN
  Top 0.635: 41.75,44 43,42.75 U1.3 | 41.75,44 40.5,44 C2.1 | SW3.P$3 39.5,57.75 44.14,53.11 44.19,53.11 44.56,52.74 44.56,45.37 44.19,44.99 42.49,44.99 41.75,44.25 41.75,44

### Text on the board
Dimension: V-CUT | V-CUT
tNames: Could you write production code here? | ON | OFF | EN | VIN | BOOT | GND | GND | RX | TX | 3.3V | GND | 3.3V | 33 | 25 | 26 | 27 | 14 | 12 | 22 | 21 | 19 | 18 | 5 | 23 | GND | GND | 3.3V | 4 | SVP | 2 | SVN | 15 | 34 | 13 | 35 | 3.3V | 32 | GND | GND | VIN
bNames: 2023/01/04 / Nanraka / ESP32_IoT_Board_ver1